# EAGLE design can-isolator-1.1 (EAGLE 6.4)
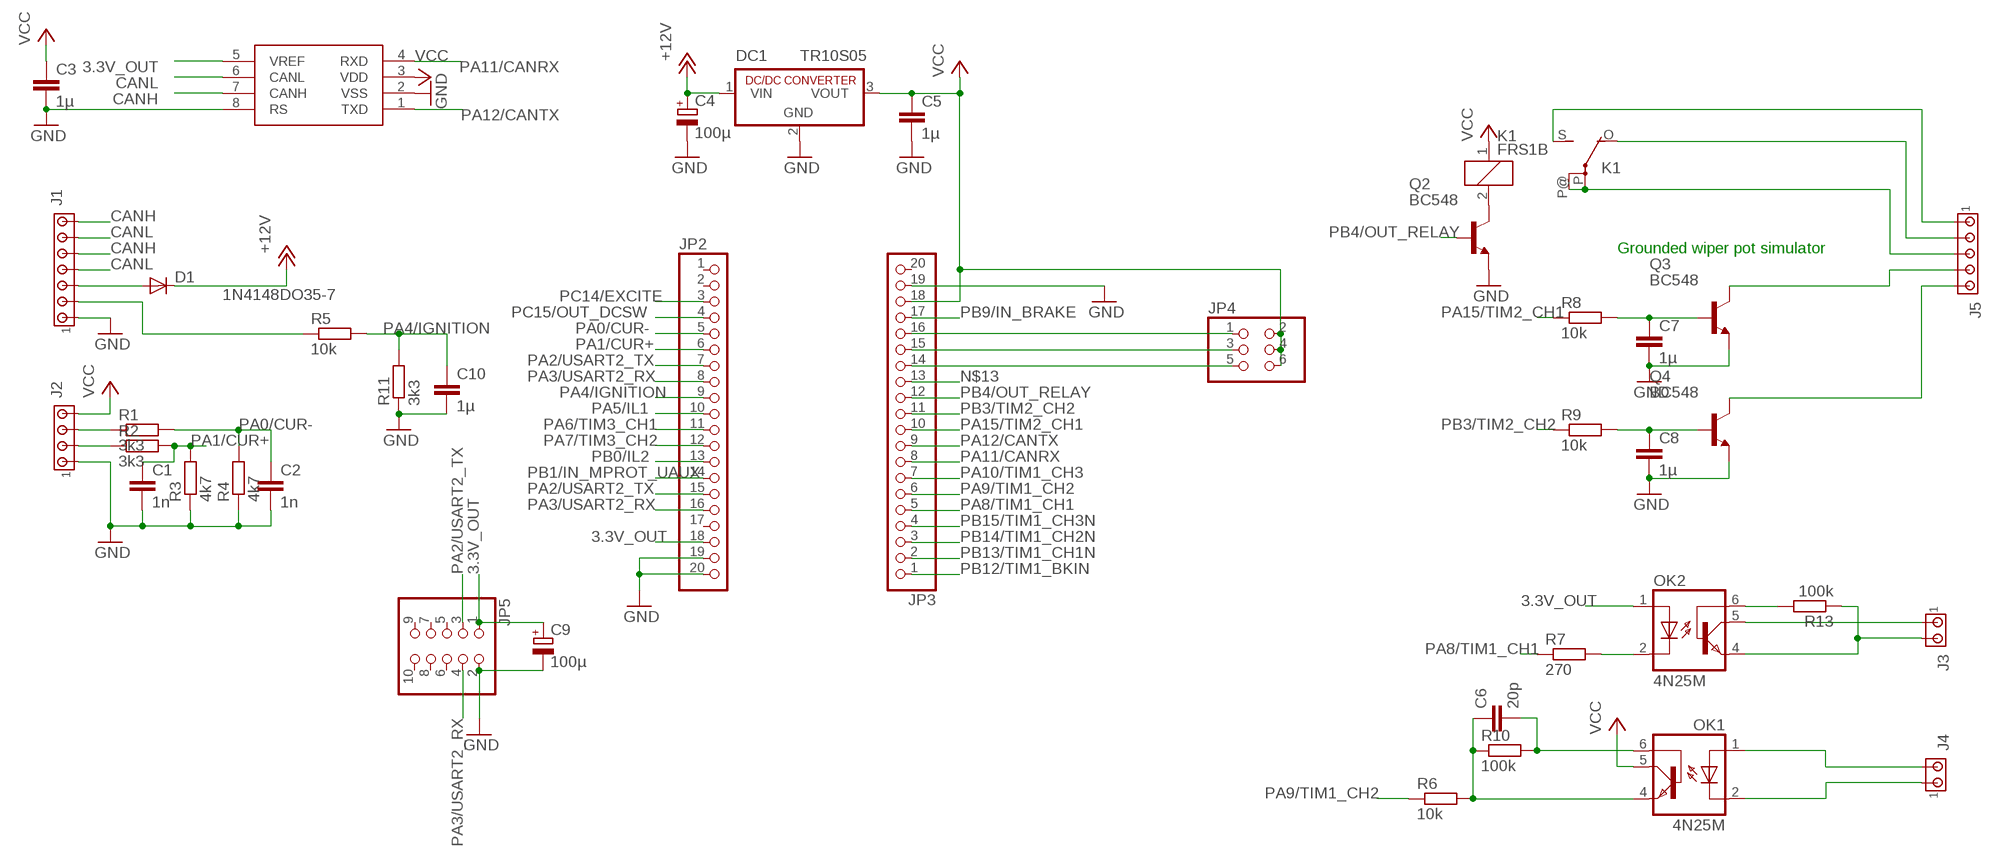
[diagram p0: schematic, sheet 1]

## Parts
C1  1n  C-EU025-024X044  [C025-024X044]
C2  1n  C-EU025-024X044  [C025-024X044]
C3  1µ  C-EU025-024X044  [C025-024X044]
C4  100µ  CPOL-EUE2-5  [E2-5]
C5  1µ  C-EU025-024X044  [C025-024X044]
C6  20p  C-EU025-024X044  [C025-024X044]
C7  1µ  C-EU025-024X044  [C025-024X044]
C8  1µ  C-EU025-024X044  [C025-024X044]
C9  100µ  CPOL-EUE2-5  [E2-5]
C10  1µ  C-EU025-024X044  [C025-024X044]
D1  1N4148DO35-7  [DO35-7]
DC1  TR10S05  R-78C5.0-1.0  [SIP3]
IC1  MCP2562P  MCP2551P  [DIL08]
J1  MTA07-100  [10X07MTA]
J2  MTA04-100  [10X04MTA]
J3  MTA02-100  [10X02MTA]
J4  MTA02-100  [10X02MTA]
J5  MTA05-100  [10X05MTA]
JP2  PINHD-1X20  [1X20]
JP3  PINHD-1X20  [1X20]
JP4  PINHD-2X3  [2X03]
JP5  PINHD-2X5/90  [2X05/90]
K1  FRS1B  [FRS1B]
OK1  4N25M  [DIL06]
OK2  4N25M  [DIL06]
Q2  BC548  [TO92-EBC]
Q3  BC548  [TO92-EBC]
Q4  BC548  [TO92-EBC]
R1  3k3  R-EU_0207/10  [0207/10]
R2  3k3  R-EU_0207/10  [0207/10]
R3  4k7  R-EU_0207/10  [0207/10]
R4  4k7  R-EU_0207/10  [0207/10]
R5  10k  R-EU_0207/10  [0207/10]
R6  10k  R-EU_0207/10  [0207/10]
R7  270  R-EU_0207/10  [0207/10]
R8  10k  R-EU_0207/10  [0207/10]
R9  10k  R-EU_0207/10  [0207/10]
R10  100k  R-EU_0207/10  [0207/10]
R11  3k3  R-EU_0207/10  [0207/10]
R13  100k  R-EU_0207/10  [0207/10]

## Nets
3.3V_OUT: C9.+ IC1.5(VREF) JP2.18 JP5.1 OK2.1(A)
+12V: C4.+ D1.C DC1.1(VIN)
CANH: IC1.7(CANH) J1.5 J1.7
CANL: IC1.6(CANL) J1.4 J1.6
GND: C1.2 C2.2 C3.2 C4.- C5.2 C7.2 C8.2 C9.- C10.2 DC1.2(GND) IC1.2(VSS) IC1.8(RS) J1.1 J2.1 JP2.19 JP2.20 JP3.19 JP5.2 Q2.E Q3.E Q4.E R3.1 R4.1 R11.1
IGNITION: J1.2 R5.1
N$1: C7.1 Q3.B R8.2
N$2: J5.4 Q3.C
N$3: C8.1 Q4.B R9.2
N$4: J5.5 Q4.C
N$5: K1.2 Q2.C
N$6: J5.3 K1.P(2:P) K1.P@(2:P)
N$7: J5.2 K1.O(2:O)
N$8: J5.1 K1.S(2:S)
N$9: OK2.2(C) R7.2
N$10: OK2.6(BAS) R13.2
N$11: J3.2 OK2.4(EMI) R13.1
N$12: J3.1 OK2.5(COL)
N$13: JP3.13
N$14: J4.2 OK1.1(A)
N$15: J4.1 OK1.2(C)
N$16: C6.2 OK1.6(BAS) R10.2
N$17: C6.1 OK1.4(EMI) R6.2 R10.1
N$18: JP3.14 JP4.5
N$20: JP3.15 JP4.3
N$21: JP3.16 JP4.1
N$22: J2.3 R1.1
N$23: J2.2 R2.1
N$27: D1.A J1.3
PA0/CUR-: C2.1 JP2.5 R1.2 R4.2
PA1/CUR+: C1.1 JP2.6 R2.2 R3.2
PA2/USART2_TX: JP2.7 JP2.15 JP5.3
PA3/USART2_RX: JP2.8 JP2.16 JP5.4
PA4/IGNITION: C10.1 JP2.9 R5.2 R11.2
PA5/IL1: JP2.10
PA6/TIM3_CH1: JP2.11
PA7/TIM3_CH2: JP2.12
PA8/TIM1_CH1: JP3.5 R7.1
PA9/TIM1_CH2: JP3.6 R6.1
PA10/TIM1_CH3: JP3.7
PA11/CANRX: IC1.4(RXD) JP3.8
PA12/CANTX: IC1.1(TXD) JP3.9
PA15/TIM2_CH1: JP3.10 R8.1
PB0/IL2: JP2.13
PB1/IN_MPROT_UAUX: JP2.14
PB3/TIM2_CH2: JP3.11 R9.1
PB4/OUT_RELAY: JP3.12 Q2.B
PB9/IN_BRAKE: JP3.17
PB12/TIM1_BKIN: JP3.1
PB13/TIM1_CH1N: JP3.2
PB14/TIM1_CH2N: JP3.3
PB15/TIM1_CH3N: JP3.4
PC14/EXCITE: JP2.3
PC15/OUT_DCSW: JP2.4
VCC: C3.1 C5.1 DC1.3(VOUT) IC1.3(VDD) J2.4 JP3.18 JP4.2 JP4.4 JP4.6 K1.1 OK1.5(COL)
Unconnected: JP2.1 JP2.2 JP2.17 JP3.20 JP5.5 JP5.6 JP5.7 JP5.8 JP5.9 JP5.10

## Notes on the sheet
- Grounded wiper pot simulator

## Library data of the parts
C1-C3 C5-C8 C10 = rcl:C-EU: CAPACITOR, European symbol
C4 C9 = rcl:CPOL-EU: POLARIZED CAPACITOR, European symbol
D1 = diode:1N4148: DIODE high speed (Philips)
DC1 = dc-dc-converter:R-78C*-1.0: INNOLINE DC/DC-Converter 1.0 AMP SIP3 Single Output Source: Data sheet <http://www.mikrocontroller.net/attachment/150645/157764-da-01-en-DC_DC_WANDLER_R_78C5_0_1_0.pdf>
IC1 = SparkFun-DigitalIC:MCP2551: CAN transceiver
J1 = con-amp:MTA07-100: AMP connector
J2 = con-amp:MTA04-100: AMP connector
J3 J4 = con-amp:MTA02-100: AMP connector
J5 = con-amp:MTA05-100: AMP connector
JP2 JP3 = pinhead:PINHD-1X20: PIN HEADER
JP4 = pinhead:PINHD-2X3: PIN HEADER
JP5 = pinhead:PINHD-2X5: PIN HEADER
K1 = relay:FRS1B: RELAY 1 x switch, same as V23101-D6-A201, Siemens; OC_FARNELL: unknown; OC_NEWARK: unknown
OK1 OK2 = optocoupler:4N*?M: General Purpose 6-Pin Phototransistor Optocouplers Source: http://www.fairchildsemi.com/ds/4N/4N35-M.pdf; MPN: 4N25-M; OC_FARNELL: 1021349; OC_NEWARK: 98K9084
Q2-Q4 = transistor-npn:BC548*: NPN Transistor
R1-R11 R13 = rcl:R-EU_: RESISTOR, European symbol

## Board
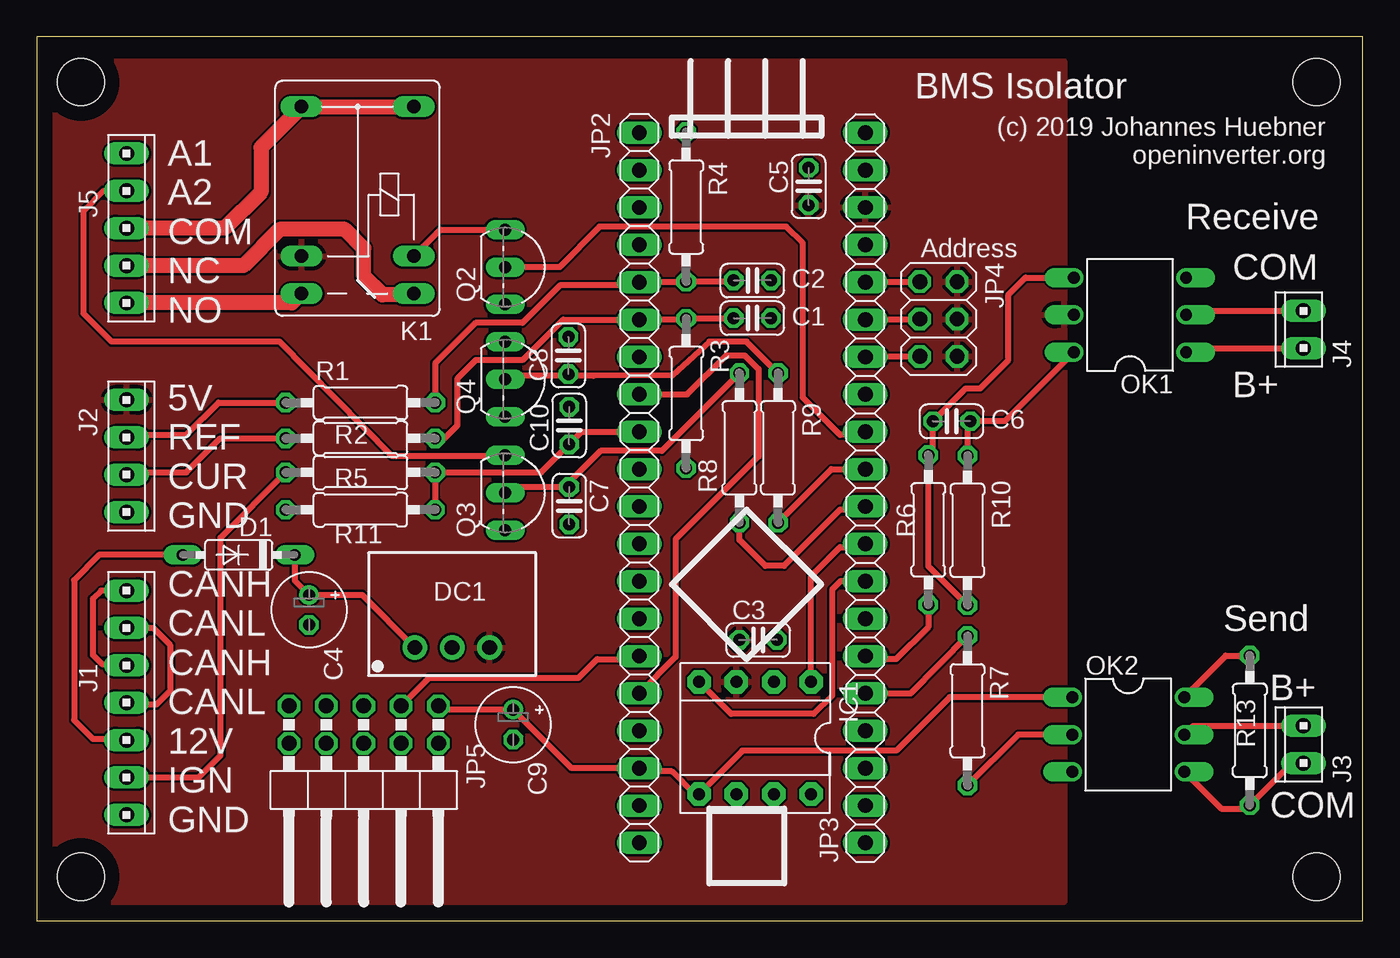
[diagram p1: board, top side]
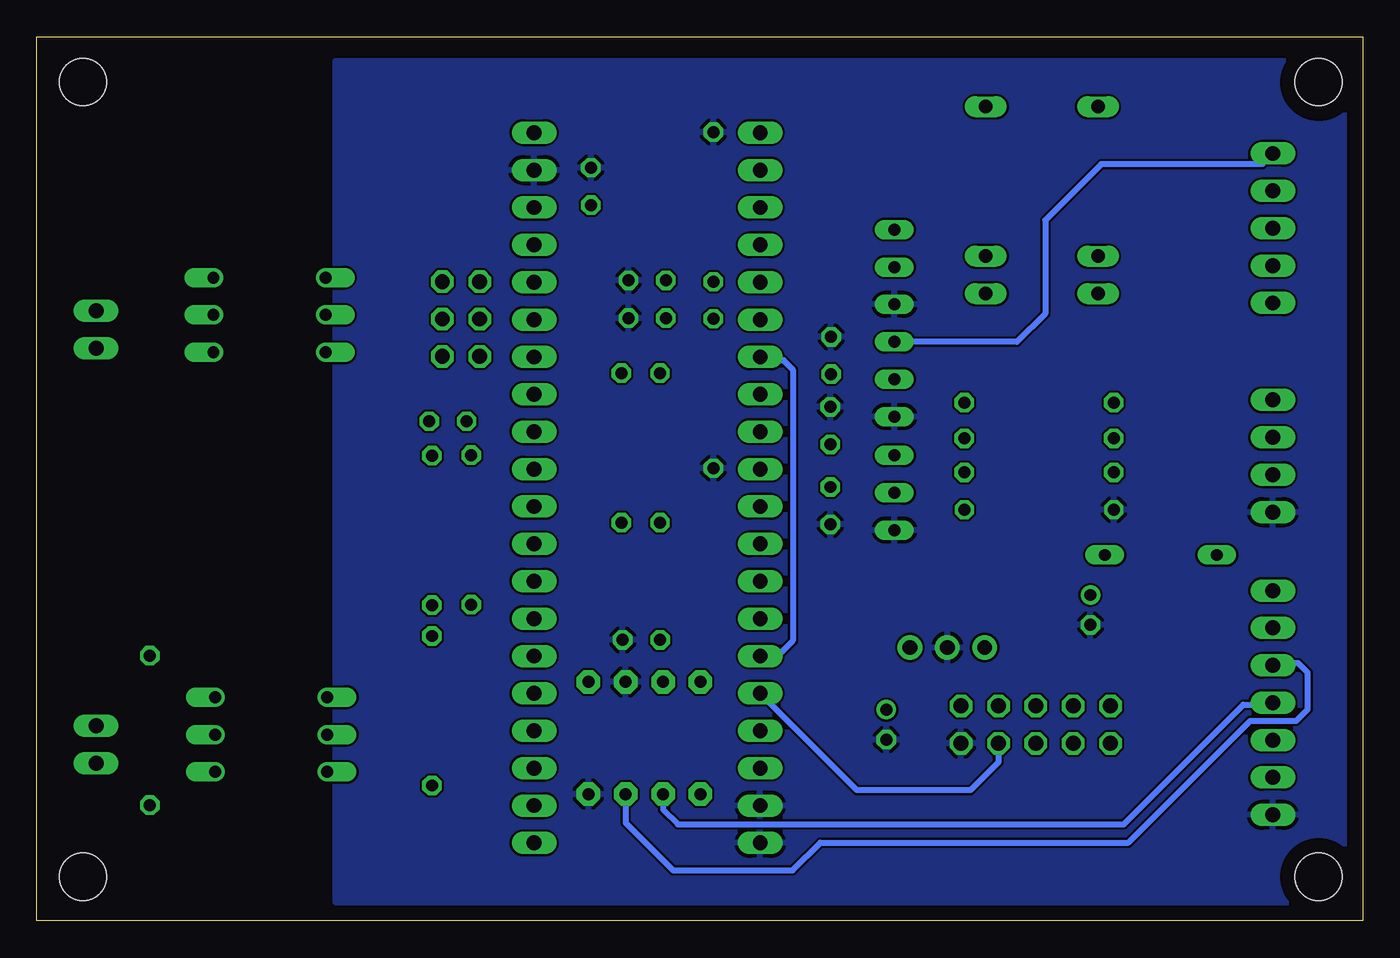
[diagram p2: board, bottom side, seen from below]

Size 90.14 x 60.08 mm. Coordinates in mm from the lower left corner, seen from the top.
Outline: 0,0 90.14,0 90.14,60.08 0,60.08 0,0
Copper layers (1*16): Top 0.035mm / dielectric 1.5mm / Bottom 0.035mm
Design rules "All PCB": minimum track width 10mil, minimum drill 0.4mm, track to track 6mil, track to pad 6mil, pad to pad 6mil, via to via 6mil, smd to smd 6mil, copper to edge 40mil, drill to drill 8mil, minimum pad ring 10mil, minimum via ring 8mil, stop-mask expansion 4mil, vias tented up to drill 0mil, thermal gap 10mil
Holes 3.2 mm at 3,3 87,3 87,57 3,57

### Footprints (pad centres in the part's own frame; a part is rotated, then mirrored left to right if it is on the bottom)
C025-024X044 = drill 0.813 octagon: 1 -1.27,0; 2 1.27,0
E2-5 = drill 0.813 pad 1.27: + -1.016,0 | drill 0.813 pad 1.27 octagon: - 1.016,0
DO35-7 = drill 0.813 long: A 3.81,0; C -3.81,0
SIP3 = drill 1 pad 1.676: 1 -2.54,0; 2 0,0; 3 2.54,0
DIL08 = drill 0.813 pad 1.6 octagon: 1 -3.81,-3.81; 2 -1.27,-3.81; 3 1.27,-3.81; 4 3.81,-3.81; 5 3.81,3.81; 6 1.27,3.81; 7 -1.27,3.81; 8 -3.81,3.81
10X07MTA = drill 1.016 long: 1 7.62,0; 2 5.08,0; 3 2.54,0; 4 0,0; 5 -2.54,0; 6 -5.08,0; 7 -7.62,0
10X04MTA = drill 1.016 long: 1 3.81,0; 2 1.27,0; 3 -1.27,0; 4 -3.81,0
10X02MTA = drill 1.016 long: 1 1.27,0; 2 -1.27,0
10X05MTA = drill 1.016 long: 1 5.08,0; 2 2.54,0; 3 0,0; 4 -2.54,0; 5 -5.08,0
1X20 = drill 1.016 long: 1 -24.13,0; 2 -21.59,0; 3 -19.05,0; 4 -16.51,0; 5 -13.97,0; 6 -11.43,0; 7 -8.89,0; 8 -6.35,0; 9 -3.81,0; 10 -1.27,0; 11 1.27,0; 12 3.81,0; 13 6.35,0; 14 8.89,0; 15 11.43,0; 16 13.97,0; 17 16.51,0; 18 19.05,0; 19 21.59,0; 20 24.13,0
2X03 = drill 1.016 octagon: 1 -2.54,-1.27; 2 -2.54,1.27; 3 0,-1.27; 4 0,1.27; 5 2.54,-1.27; 6 2.54,1.27
2X05/90 = drill 1.016 octagon: 1 -5.08,-6.35; 2 -5.08,-3.81; 3 -2.54,-6.35; 4 -2.54,-3.81; 5 0,-6.35; 6 0,-3.81; 7 2.54,-6.35; 8 2.54,-3.81; 9 5.08,-6.35; 10 5.08,-3.81
FRS1B = drill 0.914 long: 1 0,3.81; 2 0,-3.81; O -2.54,-3.81; P 10.16,3.81; P@ 10.16,-3.81; S -2.54,3.81
DIL06 = drill 0.813 offset: 1 -2.54,-3.81; 2 0,-3.81; 3 2.54,-3.81; 4 2.54,3.81; 5 0,3.81; 6 -2.54,3.81
TO92-EBC = drill 0.813 long: B 0,-1.27; C -2.54,-1.27; E 2.54,-1.27
0207/10 = drill 0.813 octagon: 1 -5.08,0; 2 5.08,0

### Placement (x,y rotation side)
C1  48.64,40.96 0 top
C2  48.64,43.52 0 top
C3  49.03,19.09 0 top
C4  18.51,21.13 270 top
C5  52.47,49.91 90 top
C6  62.19,33.95 0 top
C7  36.2,28.21 270 top
C8  36.13,38.42 90 top
C9  32.38,13.34 270 top
C10  36.2,33.66 90 top
D1  13.73,24.86 180 top
DC1  28.24,18.57 0 top
IC1  48.84,12.43 180 top
J1  6.11,14.83 270 top
J2  6.11,31.59 270 top
J3  86.11,11.99 90 top
J4  86.11,40.19 90 top
J5  6.11,47.07 270 top
JP2  40.96,29.43 270 top
JP3  56.32,29.43 90 top
JP4  61.3,40.9 270 top
JP5  22.23,8.26 180 top
K1  21.81,45.17 90 top
OK1  74.32,41.18 90 top
OK2  74.2,12.66 270 top
Q2  33.12,44.43 270 top
Q3  33.12,29.09 270 top
Q4  33.12,36.81 270 top
R1  22.01,35.22 0 top
R2  22.01,32.8 0 top
R3  44.15,35.84 90 top
R4  44.15,48.52 270 top
R5  22.01,30.48 0 top
R6  60.61,26.57 90 top
R7  63.27,14.28 270 top
R8  47.77,32.15 90 top
R9  50.39,32.15 90 top
R10  63.27,26.54 90 top
R11  22,27.94 0 top
R13  82.46,12.94 90 top

### Tracks (layer width: path | path; a pad name or v marks a point on that pad's centre or on a via)
3.3V_OUT
  Top 0.406: JP5.1 27.56,14.35 C9.+ 36.36,10.38 JP2.18 41.18,10.16 43.18,10.16 44.73,8.62 IC1.5 47.97,11.56 58.44,11.56 62.08,15.2 OK2.1
+12V
  Top 0.406: D1.C 17.54,23.12 C4.+ 22.13,22.15 DC1.1
CANH
  Top 0.406: J1.7 4.37,22.45 3.81,21.89 3.81,18.08 4.45,17.45 6.03,17.45 J1.5
  Bottom 0.406: IC1.7 50.1,6.67 46.88,3.44 38.75,3.44 36.88,5.31 15.94,5.31 7.66,13.59 4.53,13.59 3.75,14.38 3.75,16.88 4.38,17.51 5.97,17.51 J1.5
CANL
  Top 0.406: J1.6 7.91,19.91 9.06,18.75 9.06,15.62 8.12,14.69 6.25,14.69 J1.4
  Bottom 0.406: IC1.6 47.56,7.57 46.56,6.56 16.25,6.56 8.12,14.69 6.25,14.69 J1.4
GND
  pour Bottom: 1.27,58.42 69.85,58.42 69.85,1.27 1.27,1.27
IGNITION
  Top 0.406: J1.2 11,9.75 12.5,11.25 12.5,26.05 R5.1
N$1
  Top 0.406: R8.2 42.5,31.93 38.31,31.93 36.2,29.82 C7.1 32.24,29.48 Q3.B
N$2
  Top 0.406: J5.4 4.53,49.61 3.17,48.26 3.17,41.27 5.08,39.37 16.51,39.37 24.13,31.6 31.75,31.6 Q3.C
N$3
  Top 0.406: R9.2 48.25,39.37 45.72,39.37 43.21,37.07 37.84,37.04 36.26,37.04 | 36.26,37.04 C8.1 | 36.26,37.04 31.85,37.04 Q4.B
N$4
  Bottom 0.406: J5.5 6.83,51.44 17.78,51.44 21.59,47.62 21.59,41.27 23.52,39.35 Q4.C
N$5
  Top 0.406: K1.2 27.42,46.97 Q2.C
N$6
  Top 1.016: J5.3 12.78,47.07 15.24,49.53 15.24,52.57 K1.P K1.P@
N$7
  Top 1.016: K1.O 25.54,42.55 23.5,42.55 22.23,43.81 22.23,45.72 20.95,46.99 16.51,46.99 14.05,44.53 J5.2
N$8
  Top 1.016: K1.S 17.36,41.99 J5.1
N$9
  Top 0.406: OK2.2 66.73,12.66 R7.2
N$10
  Top 0.406: OK2.6 80.83,18.02 R13.2
N$11
  Top 0.406: OK2.4 80.51,7.62 82.55,7.62 82.46,7.71 R13.1 85.32,10.72 J3.2
N$12
  Top 0.406: OK2.5 78.61,13.26 J3.1
N$14
  Top 0.406: OK1.1 78.41,38.92 J4.2
N$15
  Top 0.406: OK1.2 78.41,41.46 J4.1
N$16
  Top 0.406: OK1.6 65.83,33.95 C6.2 63.27,33.77 R10.2
N$17
  Top 0.406: R10.1 60.61,24.11 R6.2 60.92,31.96 C6.1 63.16,36.2 64.14,36.2 66.04,38.1 66.04,42.55 67.22,43.72 OK1.4
N$18
  Top 0.406: JP4.5 59.59,38.32 JP3.14
N$20
  Top 0.406: JP4.3 59.59,40.86 JP3.15
N$21
  Top 0.406: JP4.1 59.59,43.4 JP3.16
N$22
  Top 0.406: J2.3 6.27,33.02 10.16,33.02 12.36,35.22 R1.1
N$23
  Top 0.406: J2.2 6.27,30.48 10.16,30.48 12.47,32.8 R2.1
N$27
  Top 0.406: D1.A 4.24,24.86 2.54,23.16 2.54,13.64 3.81,12.37 6.03,12.37 J1.3
PA0/CUR-
  Top 0.406: C2.1 47.45,43.44 R4.2 43.48,43.4 JP2.5 40.74,43.18 35.56,43.18 33.02,40.64 29.84,40.64 27.09,37.88 R1.2
PA1/CUR+
  Top 0.406: C1.1 47.33,40.92 R3.2 43.89,41.18 43.57,40.86 JP2.6 35.78,40.86 33.02,38.1 29.84,38.1 28.57,36.83 28.57,33.66 27.71,32.8 R2.2
PA2/USART2_TX
  Top 0.406: JP5.3 26.67,16.51 36.83,16.51 38.1,17.78 40.74,17.78 JP2.15
  Bottom 0.406: JP2.7 40.74,38.1 39.37,38.1 38.73,37.47 38.73,19.05 39.78,18 JP2.15
PA3/USART2_RX
  Top 0.406: JP2.8 44.22,35.78 46.88,38.44 48.12,38.44 49.06,37.5 49.06,31.56 43.44,25.94 43.44,17.94 JP2.16
  Bottom 0.406: JP5.4 24.77,10.79 26.67,8.89 34.39,8.89 JP2.16
PA4/IGNITION
  Top 0.406: R11.2 R5.2 34.29,30.48 C10.1 37.05,33.24 JP2.9
PA8/TIM1_CH1
  Top 0.406: JP3.5 59.42,15.46 R7.1
PA9/TIM1_CH2
  Top 0.406: R6.1 60.61,19.97 58.42,17.78 56.54,17.78 JP3.6
PA11/CANRX
  Top 0.406: JP3.8 54.64,23.08 54.06,22.5 54.06,15.31 52.81,14.06 47.2,14.06 IC1.4
PA12/CANTX
  Top 0.406: IC1.1 52.65,23.43 54.61,25.4 56.1,25.4 JP3.9
PA15/TIM2_CH1
  Top 0.406: JP3.10 55.78,27.94 54.61,27.94 50.8,24.13 49.53,24.13 47.77,25.89 R8.1
PB3/TIM2_CH2
  Top 0.406: R9.1 54.02,30.7 JP3.11
PB4/OUT_RELAY
  Top 0.406: JP3.12 56.1,33.02 54.61,33.02 52.07,35.56 52.07,46.07 50.95,47.19 38.25,47.19 35.54,44.43 Q2.B
VCC
  pour Top: 1.27,58.42 69.85,58.42 69.85,1.27 1.27,1.27

### Text on the board
tNames: BMS Isolator | (c) 2019 Johannes Huebner / openinverter.org | Receive | Address | A1 / A2 / COM / NC / NO | COM / / / B+ | 5V / REF / CUR / GND | Send | B+ / / / COM | CANH / CANL / CANH / CANL / 12V / IGN / GND